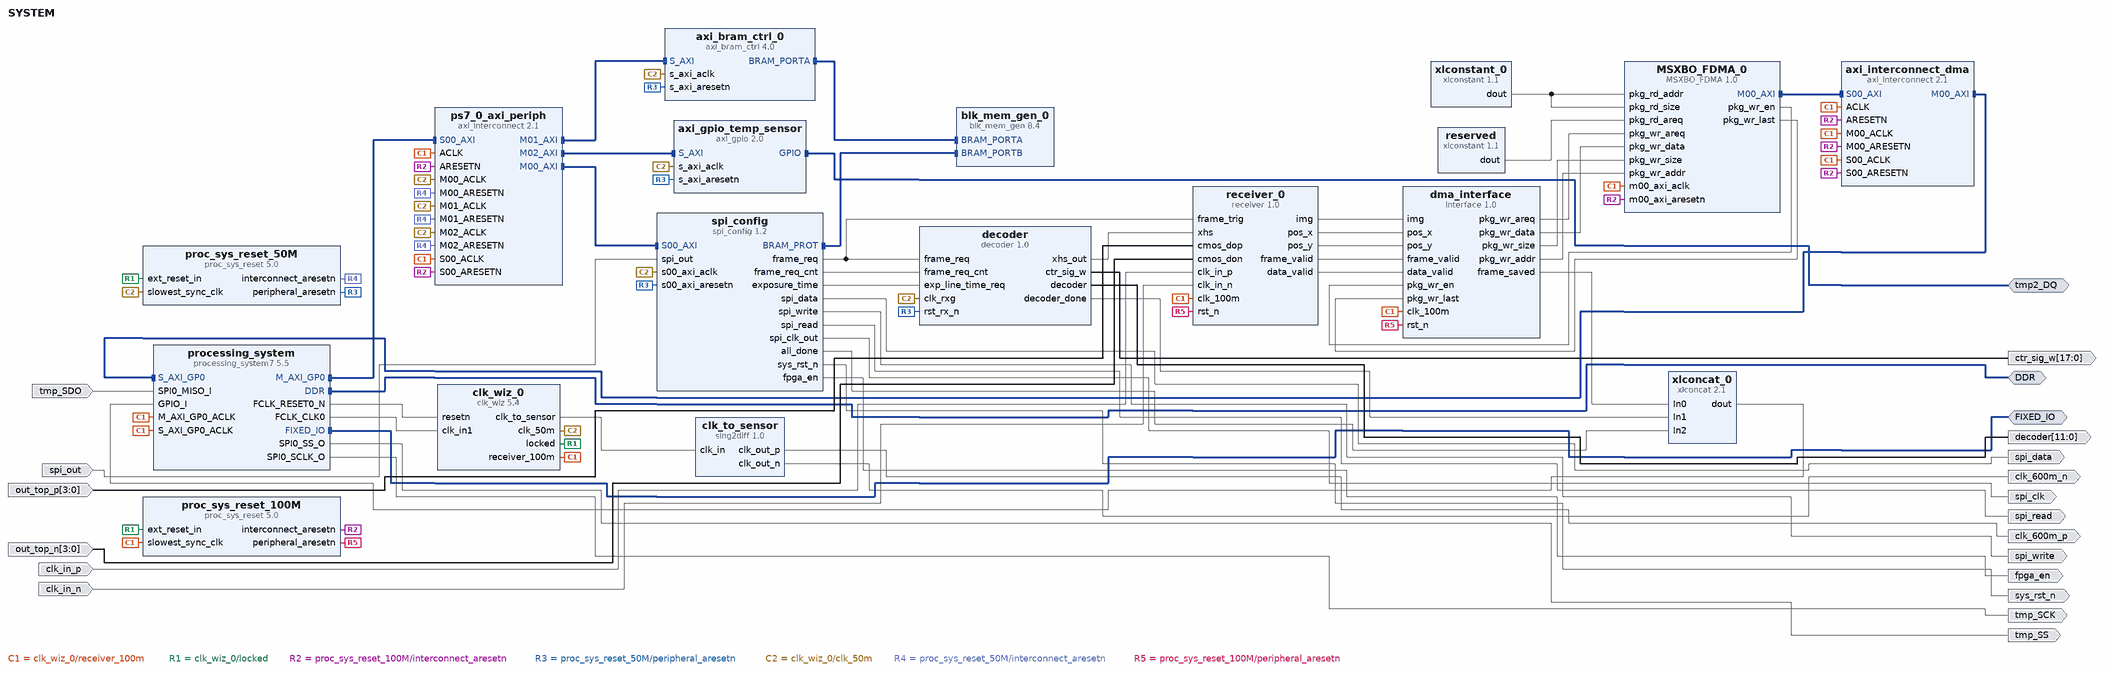
[diagram p0: block diagram of the top level]
# Vivado block design SYSTEM, xc7z035ffg676-2, Vivado 2017.4
create_bd_design SYSTEM

create_bd_intf_port -mode Master -vlnv xilinx.com:interface:ddrx_rtl:1.0 DDR
create_bd_intf_port -mode Master -vlnv xilinx.com:display_processing_system7:fixedio_rtl:1.0 FIXED_IO
create_bd_intf_port -mode Master -vlnv xilinx.com:interface:gpio_rtl:1.0 tmp2_DQ
create_bd_port -dir O -from 17 -to 0 ctr_sig_w
create_bd_port -dir O -from 11 -to 0 decoder
create_bd_port -dir O spi_data
create_bd_port -dir O spi_write
create_bd_port -dir O spi_read
create_bd_port -dir I spi_out
create_bd_port -dir O -type clk spi_clk
create_bd_port -dir I tmp_SDO
create_bd_port -dir O tmp_SS
create_bd_port -dir O tmp_SCK
create_bd_port -dir I -from 3 -to 0 out_top_p
create_bd_port -dir I -from 3 -to 0 out_top_n
create_bd_port -dir I clk_in_p
create_bd_port -dir I clk_in_n
create_bd_port -dir O -type rst sys_rst_n
create_bd_port -dir O fpga_en
create_bd_port -dir O clk_600m_p
create_bd_port -dir O clk_600m_n

create_bd_cell -type ip -vlnv xilinx.com:ip:processing_system7:5.5 processing_system
set_property -dict [list \
  CONFIG.PCW_FCLK_CLK0_BUF FALSE \
  CONFIG.PCW_QSPI_PERIPHERAL_FREQMHZ 125 \
  CONFIG.PCW_SDIO_PERIPHERAL_FREQMHZ 100 \
  CONFIG.PCW_UART_PERIPHERAL_FREQMHZ 100 \
  CONFIG.PCW_FPGA0_PERIPHERAL_FREQMHZ 100 \
  CONFIG.PCW_USE_S_AXI_GP0 1 \
  CONFIG.PCW_USE_FABRIC_INTERRUPT 1 \
  CONFIG.PCW_GPIO_EMIO_GPIO_WIDTH 3 \
  CONFIG.PCW_PRESET_BANK1_VOLTAGE {LVCMOS 1.8V} \
  CONFIG.PCW_UIPARAM_DDR_PARTNO {MT41K256M16 RE-125} \
  CONFIG.PCW_QSPI_PERIPHERAL_ENABLE 1 \
  CONFIG.PCW_QSPI_QSPI_IO {MIO 1 .. 6} \
  CONFIG.PCW_QSPI_GRP_SINGLE_SS_ENABLE 1 \
  CONFIG.PCW_QSPI_GRP_SINGLE_SS_IO {MIO 1 .. 6} \
  CONFIG.PCW_SINGLE_QSPI_DATA_MODE x4 \
  CONFIG.PCW_ENET0_PERIPHERAL_ENABLE 1 \
  CONFIG.PCW_ENET0_ENET0_IO {MIO 16 .. 27} \
  CONFIG.PCW_ENET0_GRP_MDIO_ENABLE 1 \
  CONFIG.PCW_ENET0_GRP_MDIO_IO {MIO 52 .. 53} \
  CONFIG.PCW_SD0_PERIPHERAL_ENABLE 1 \
  CONFIG.PCW_SD0_SD0_IO {MIO 40 .. 45} \
  CONFIG.PCW_SD0_GRP_CD_ENABLE 0 \
  CONFIG.PCW_SD0_GRP_WP_ENABLE 0 \
  CONFIG.PCW_UART1_PERIPHERAL_ENABLE 1 \
  CONFIG.PCW_UART1_UART1_IO {MIO 48 .. 49} \
  CONFIG.PCW_SPI0_PERIPHERAL_ENABLE 1 \
  CONFIG.PCW_SPI0_SPI0_IO EMIO \
  CONFIG.PCW_GPIO_MIO_GPIO_ENABLE 0 \
  CONFIG.PCW_GPIO_EMIO_GPIO_ENABLE 1 \
  CONFIG.PCW_GPIO_EMIO_GPIO_IO 3 \
] [get_bd_cells processing_system]
# 145 more settings of processing_system are not shown: defaults, MIO pin electricals, DDR timing, and values the tool derives
create_bd_cell -type ip -vlnv xilinx.com:ip:clk_wiz:5.4 clk_wiz_0
set_property -dict [list \
  CONFIG.PRIMITIVE PLL \
  CONFIG.USE_DYN_PHASE_SHIFT false \
  CONFIG.CLKOUT2_USED true \
  CONFIG.CLKOUT3_USED true \
  CONFIG.NUM_OUT_CLKS 3 \
  CONFIG.CLK_OUT1_PORT receiver_100m \
  CONFIG.CLK_OUT2_PORT clk_50m \
  CONFIG.CLK_OUT3_PORT clk_to_sensor \
  CONFIG.CLKOUT1_REQUESTED_OUT_FREQ 100 \
  CONFIG.CLKOUT2_REQUESTED_OUT_FREQ 50 \
  CONFIG.CLKOUT3_REQUESTED_OUT_FREQ 600 \
  CONFIG.PRIM_SOURCE Global_buffer \
  CONFIG.CLKOUT1_DRIVES BUFG \
  CONFIG.CLKOUT2_DRIVES BUFG \
  CONFIG.CLKOUT3_DRIVES BUFG \
  CONFIG.CLKOUT4_DRIVES BUFG \
  CONFIG.CLKOUT5_DRIVES BUFG \
  CONFIG.CLKOUT6_DRIVES BUFG \
  CONFIG.CLKOUT7_DRIVES BUFG \
  CONFIG.FEEDBACK_SOURCE FDBK_AUTO \
  CONFIG.USE_RESET true \
  CONFIG.RESET_PORT resetn \
  CONFIG.MMCM_DIVCLK_DIVIDE 1 \
  CONFIG.MMCM_CLKFBOUT_MULT_F 12 \
  CONFIG.MMCM_CLKIN1_PERIOD 10.000 \
  CONFIG.MMCM_CLKIN2_PERIOD 10.000 \
  CONFIG.MMCM_COMPENSATION ZHOLD \
  CONFIG.MMCM_CLKOUT0_DIVIDE_F 12 \
  CONFIG.MMCM_CLKOUT1_DIVIDE 24 \
  CONFIG.MMCM_CLKOUT2_DIVIDE 2 \
  CONFIG.RESET_TYPE ACTIVE_LOW \
  CONFIG.CLKOUT1_JITTER 115.831 \
  CONFIG.CLKOUT1_PHASE_ERROR 87.180 \
  CONFIG.CLKOUT2_JITTER 132.683 \
  CONFIG.CLKOUT2_PHASE_ERROR 87.180 \
  CONFIG.CLKOUT3_JITTER 83.768 \
  CONFIG.CLKOUT3_PHASE_ERROR 87.180 \
] [get_bd_cells clk_wiz_0]
create_bd_cell -type ip -vlnv xilinx.com:ip:axi_interconnect:2.1 axi_interconnect_dma
set_property -dict {CONFIG.NUM_MI 1} [get_bd_cells axi_interconnect_dma]
create_bd_cell -type ip -vlnv xilinx.com:ip:axi_interconnect:2.1 ps7_0_axi_periph
set_property -dict {CONFIG.NUM_MI 3} [get_bd_cells ps7_0_axi_periph]
create_bd_cell -type ip -vlnv xilinx.com:ip:blk_mem_gen:8.4 blk_mem_gen_0
set_property -dict [list \
  CONFIG.Memory_Type True_Dual_Port_RAM \
  CONFIG.Enable_B Use_ENB_Pin \
  CONFIG.Use_RSTB_Pin true \
  CONFIG.Port_B_Clock 100 \
  CONFIG.Port_B_Write_Rate 50 \
  CONFIG.Port_B_Enable_Rate 100 \
  CONFIG.EN_SAFETY_CKT false \
] [get_bd_cells blk_mem_gen_0]
create_bd_cell -type ip -vlnv xilinx.com:ip:axi_bram_ctrl:4.0 axi_bram_ctrl_0
set_property -dict {CONFIG.SINGLE_PORT_BRAM 1 CONFIG.USE_ECC 0} [get_bd_cells axi_bram_ctrl_0]
create_bd_cell -type ip -vlnv xilinx.com:ip:proc_sys_reset:5.0 proc_sys_reset_50M
create_bd_cell -type ip -vlnv xilinx.com:ip:proc_sys_reset:5.0 proc_sys_reset_100M
create_bd_cell -type ip -vlnv xilinx.com:ip:axi_gpio:2.0 axi_gpio_temp_sensor
set_property -dict {CONFIG.C_GPIO_WIDTH 1 CONFIG.C_IS_DUAL 0} [get_bd_cells axi_gpio_temp_sensor]
create_bd_cell -type ip -vlnv xilinx.com:user:MSXBO_FDMA:1.0 MSXBO_FDMA_0
set_property -dict {CONFIG.C_M00_AXI_BURST_LEN 8} [get_bd_cells MSXBO_FDMA_0]
create_bd_cell -type ip -vlnv xilinx.com:ip:xlconcat:2.1 xlconcat_0
set_property -dict {CONFIG.NUM_PORTS 3} [get_bd_cells xlconcat_0]
create_bd_cell -type ip -vlnv xilinx.com:ip:xlconstant:1.1 xlconstant_0
set_property -dict {CONFIG.CONST_WIDTH 32 CONFIG.CONST_VAL 0} [get_bd_cells xlconstant_0]
create_bd_cell -type ip -vlnv xilinx.com:user:sing2diff:1.0 clk_to_sensor
create_bd_cell -type ip -vlnv xilinx.com:ip:xlconstant:1.1 reserved
create_bd_cell -type ip -vlnv xilinx.com:user:receiver:1.0 receiver_0
create_bd_cell -type ip -vlnv xilinx.com:user:interface:1.0 dma_interface
create_bd_cell -type ip -vlnv xilinx.com:user:spi_config:1.2 spi_config
create_bd_cell -type ip -vlnv xilinx.com:user:decoder:1.0 decoder

# ---- connections ----

connect_bd_intf_net [get_bd_intf_pins MSXBO_FDMA_0/M00_AXI] [get_bd_intf_pins axi_interconnect_dma/S00_AXI]
connect_bd_intf_net -intf_net processing_system7_0_M_AXI_GP0 [get_bd_intf_pins processing_system/M_AXI_GP0] [get_bd_intf_pins ps7_0_axi_periph/S00_AXI]
connect_bd_intf_net [get_bd_intf_pins axi_bram_ctrl_0/BRAM_PORTA] [get_bd_intf_pins blk_mem_gen_0/BRAM_PORTA]
connect_bd_intf_net -intf_net spi_config_0_BRAM_PROT [get_bd_intf_pins spi_config/BRAM_PROT] [get_bd_intf_pins blk_mem_gen_0/BRAM_PORTB]
connect_bd_intf_net -intf_net axi_interconnect_0_M00_AXI [get_bd_intf_pins axi_interconnect_dma/M00_AXI] [get_bd_intf_pins processing_system/S_AXI_GP0]
connect_bd_intf_net [get_bd_intf_pins spi_config/S00_AXI] [get_bd_intf_pins ps7_0_axi_periph/M00_AXI]
connect_bd_intf_net [get_bd_intf_pins ps7_0_axi_periph/M01_AXI] [get_bd_intf_pins axi_bram_ctrl_0/S_AXI]
connect_bd_intf_net [get_bd_intf_pins ps7_0_axi_periph/M02_AXI] [get_bd_intf_pins axi_gpio_temp_sensor/S_AXI]
connect_bd_intf_net -intf_net processing_system7_0_DDR [get_bd_intf_ports DDR] [get_bd_intf_pins processing_system/DDR]
connect_bd_intf_net -intf_net processing_system7_0_FIXED_IO [get_bd_intf_ports FIXED_IO] [get_bd_intf_pins processing_system/FIXED_IO]
connect_bd_intf_net -intf_net axi_gpio_0_GPIO [get_bd_intf_ports tmp2_DQ] [get_bd_intf_pins axi_gpio_temp_sensor/GPIO]
connect_bd_net -net spi_config_0_frame_req [get_bd_pins spi_config/frame_req] [get_bd_pins receiver_0/frame_trig] [get_bd_pins decoder/frame_req]
connect_bd_net -net spi_config_0_frame_req_cnt [get_bd_pins spi_config/frame_req_cnt] [get_bd_pins decoder/frame_req_cnt]
connect_bd_net -net decoder_0_ctr_sig_w [get_bd_pins decoder/ctr_sig_w] [get_bd_ports ctr_sig_w]
connect_bd_net -net decoder_0_decoder [get_bd_pins decoder/decoder] [get_bd_ports decoder]
connect_bd_net -net spi_config_0_spi_data [get_bd_pins spi_config/spi_data] [get_bd_ports spi_data]
connect_bd_net -net spi_config_0_spi_write [get_bd_pins spi_config/spi_write] [get_bd_ports spi_write]
connect_bd_net -net spi_config_0_spi_read [get_bd_pins spi_config/spi_read] [get_bd_ports spi_read]
connect_bd_net -net spi_out_0_1 [get_bd_ports spi_out] [get_bd_pins spi_config/spi_out]
connect_bd_net -net spi_config_0_spi_clk_out [get_bd_pins spi_config/spi_clk_out] [get_bd_ports spi_clk]
connect_bd_net -net clk_wiz_0_receiver [get_bd_pins clk_wiz_0/receiver_100m] \
  [get_bd_pins proc_sys_reset_100M/slowest_sync_clk] [get_bd_pins processing_system/S_AXI_GP0_ACLK] \
  [get_bd_pins processing_system/M_AXI_GP0_ACLK] [get_bd_pins MSXBO_FDMA_0/m00_axi_aclk] [get_bd_pins receiver_0/clk_100m] \
  [get_bd_pins dma_interface/clk_100m] [get_bd_pins axi_interconnect_dma/ACLK] [get_bd_pins axi_interconnect_dma/M00_ACLK] \
  [get_bd_pins axi_interconnect_dma/S00_ACLK] [get_bd_pins ps7_0_axi_periph/ACLK] [get_bd_pins ps7_0_axi_periph/S00_ACLK]
connect_bd_net [get_bd_pins clk_wiz_0/locked] [get_bd_pins proc_sys_reset_50M/ext_reset_in] [get_bd_pins proc_sys_reset_100M/ext_reset_in]
connect_bd_net -net ARESETN_1 [get_bd_pins proc_sys_reset_100M/interconnect_aresetn] \
  [get_bd_pins MSXBO_FDMA_0/m00_axi_aresetn] [get_bd_pins ps7_0_axi_periph/ARESETN] \
  [get_bd_pins ps7_0_axi_periph/S00_ARESETN] [get_bd_pins axi_interconnect_dma/ARESETN] \
  [get_bd_pins axi_interconnect_dma/S00_ARESETN] [get_bd_pins axi_interconnect_dma/M00_ARESETN]
connect_bd_net [get_bd_pins proc_sys_reset_50M/peripheral_aresetn] \
  [get_bd_pins axi_bram_ctrl_0/s_axi_aresetn] [get_bd_pins axi_gpio_temp_sensor/s_axi_aresetn] \
  [get_bd_pins spi_config/s00_axi_aresetn] [get_bd_pins decoder/rst_rx_n]
connect_bd_net -net clk_wiz_0_decoder [get_bd_pins clk_wiz_0/clk_50m] \
  [get_bd_pins proc_sys_reset_50M/slowest_sync_clk] [get_bd_pins axi_gpio_temp_sensor/s_axi_aclk] \
  [get_bd_pins axi_bram_ctrl_0/s_axi_aclk] [get_bd_pins spi_config/s00_axi_aclk] [get_bd_pins ps7_0_axi_periph/M00_ACLK] \
  [get_bd_pins ps7_0_axi_periph/M01_ACLK] [get_bd_pins ps7_0_axi_periph/M02_ACLK] [get_bd_pins decoder/clk_rxg]
connect_bd_net -net SPI0_MISO_I_0_1 [get_bd_ports tmp_SDO] [get_bd_pins processing_system/SPI0_MISO_I]
connect_bd_net [get_bd_pins processing_system/SPI0_SS_O] [get_bd_ports tmp_SS]
connect_bd_net [get_bd_pins processing_system/SPI0_SCLK_O] [get_bd_ports tmp_SCK]
connect_bd_net [get_bd_pins processing_system/FCLK_RESET0_N] [get_bd_pins clk_wiz_0/resetn]
connect_bd_net [get_bd_pins xlconcat_0/dout] [get_bd_pins processing_system/GPIO_I]
connect_bd_net [get_bd_pins decoder/decoder_done] [get_bd_pins xlconcat_0/In1]
connect_bd_net [get_bd_pins proc_sys_reset_50M/interconnect_aresetn] \
  [get_bd_pins ps7_0_axi_periph/M00_ARESETN] [get_bd_pins ps7_0_axi_periph/M01_ARESETN] \
  [get_bd_pins ps7_0_axi_periph/M02_ARESETN]
connect_bd_net [get_bd_pins processing_system/FCLK_CLK0] [get_bd_pins clk_wiz_0/clk_in1]
connect_bd_net -net data_in_from_pins_p_0_1 [get_bd_ports out_top_p] [get_bd_pins receiver_0/cmos_dop]
connect_bd_net -net data_in_from_pins_n_0_1 [get_bd_ports out_top_n] [get_bd_pins receiver_0/cmos_don]
connect_bd_net [get_bd_ports clk_in_p] [get_bd_pins receiver_0/clk_in_p]
connect_bd_net [get_bd_ports clk_in_n] [get_bd_pins receiver_0/clk_in_n]
connect_bd_net [get_bd_pins proc_sys_reset_100M/peripheral_aresetn] [get_bd_pins receiver_0/rst_n] [get_bd_pins dma_interface/rst_n]
connect_bd_net [get_bd_pins decoder/xhs_out] [get_bd_pins receiver_0/xhs]
connect_bd_net [get_bd_pins receiver_0/img] [get_bd_pins dma_interface/img]
connect_bd_net [get_bd_pins receiver_0/pos_x] [get_bd_pins dma_interface/pos_x]
connect_bd_net [get_bd_pins receiver_0/pos_y] [get_bd_pins dma_interface/pos_y]
connect_bd_net [get_bd_pins receiver_0/frame_valid] [get_bd_pins dma_interface/frame_valid]
connect_bd_net [get_bd_pins receiver_0/data_valid] [get_bd_pins dma_interface/data_valid]
connect_bd_net [get_bd_pins MSXBO_FDMA_0/pkg_wr_en] [get_bd_pins dma_interface/pkg_wr_en]
connect_bd_net [get_bd_pins dma_interface/pkg_wr_areq] [get_bd_pins MSXBO_FDMA_0/pkg_wr_areq]
connect_bd_net [get_bd_pins dma_interface/pkg_wr_data] [get_bd_pins MSXBO_FDMA_0/pkg_wr_data]
connect_bd_net [get_bd_pins dma_interface/pkg_wr_size] [get_bd_pins MSXBO_FDMA_0/pkg_wr_size]
connect_bd_net [get_bd_pins dma_interface/pkg_wr_addr] [get_bd_pins MSXBO_FDMA_0/pkg_wr_addr]
connect_bd_net [get_bd_pins xlconstant_0/dout] [get_bd_pins MSXBO_FDMA_0/pkg_rd_addr] [get_bd_pins MSXBO_FDMA_0/pkg_rd_size]
connect_bd_net [get_bd_pins spi_config/exposure_time] [get_bd_pins decoder/exp_line_time_req]
connect_bd_net [get_bd_pins spi_config/sys_rst_n] [get_bd_ports sys_rst_n]
connect_bd_net [get_bd_pins spi_config/fpga_en] [get_bd_ports fpga_en]
connect_bd_net [get_bd_pins clk_wiz_0/clk_to_sensor] [get_bd_pins clk_to_sensor/clk_in]
connect_bd_net -net sing2diff_0_clk_out_p [get_bd_pins clk_to_sensor/clk_out_p] [get_bd_ports clk_600m_p]
connect_bd_net -net sing2diff_0_clk_out_n [get_bd_pins clk_to_sensor/clk_out_n] [get_bd_ports clk_600m_n]
connect_bd_net [get_bd_pins reserved/dout] [get_bd_pins MSXBO_FDMA_0/pkg_rd_areq]
connect_bd_net [get_bd_pins spi_config/all_done] [get_bd_pins xlconcat_0/In2]
connect_bd_net [get_bd_pins MSXBO_FDMA_0/pkg_wr_last] [get_bd_pins dma_interface/pkg_wr_last]
connect_bd_net [get_bd_pins dma_interface/frame_saved] [get_bd_pins xlconcat_0/In0]

# ---- address map ----
assign_bd_address -offset 0x00000000 -range 1G -target_address_space [get_bd_addr_spaces MSXBO_FDMA_0/M00_AXI] [get_bd_addr_segs processing_system/S_AXI_GP0/GP0_DDR_LOWOCM]
assign_bd_address -offset 0x40000000 -range 1G -target_address_space [get_bd_addr_spaces MSXBO_FDMA_0/M00_AXI] [get_bd_addr_segs processing_system/S_AXI_GP0/GP0_M_AXI_GP0]
assign_bd_address -offset 0xE0000000 -range 4M -target_address_space [get_bd_addr_spaces MSXBO_FDMA_0/M00_AXI] [get_bd_addr_segs processing_system/S_AXI_GP0/GP0_IOP]
assign_bd_address -offset 0xFC000000 -range 16M -target_address_space [get_bd_addr_spaces MSXBO_FDMA_0/M00_AXI] [get_bd_addr_segs processing_system/S_AXI_GP0/GP0_QSPI_LINEAR]
assign_bd_address -offset 0x40000000 -range 4K -target_address_space [get_bd_addr_spaces processing_system/Data] [get_bd_addr_segs axi_bram_ctrl_0/S_AXI/Mem0]
assign_bd_address -offset 0x41200000 -range 64K -target_address_space [get_bd_addr_spaces processing_system/Data] [get_bd_addr_segs axi_gpio_temp_sensor/S_AXI/Reg]
assign_bd_address -offset 0x43C00000 -range 64K -target_address_space [get_bd_addr_spaces processing_system/Data] [get_bd_addr_segs spi_config/S00_AXI/S00_AXI_reg]

validate_bd_design
save_bd_design
